# Altium schematic sheet PCB_MFG.SchDoc: PCB Manufacturing
size A4; Address1: Smoka Wawelskiego 1; Address2: 30-535 Kraków, Poland; DocumentNumber: 9; Revision: v01; SheetNumber: 9; SheetTotal: 9; Author: Miroslaw Folejewski; CompanyName: Mirko Electronics; DrawnBy: Miroslaw Folejewski; Engineer: Miroslaw Folejewski; PageSetup: Record=PageOptions|CenterHorizontal=True|CenterVertical=True|PrintScale=1.00|XCorrection=1.00|YCorrection=1.00|PrintKind=0|BorderSize=5000000|LeftOffset=0|BottomOffset=0|Orientation=2|PaperLength=1000|PaperWidth=1000|Scale=100|PaperSource=7|PrintQuality=-4|MediaType=1|DitherType=10|PaperKind=A4|PrintScaleMode=1; PageSize: A4; Designators: -; ProjectName: 7-Segment LED Matrix Display
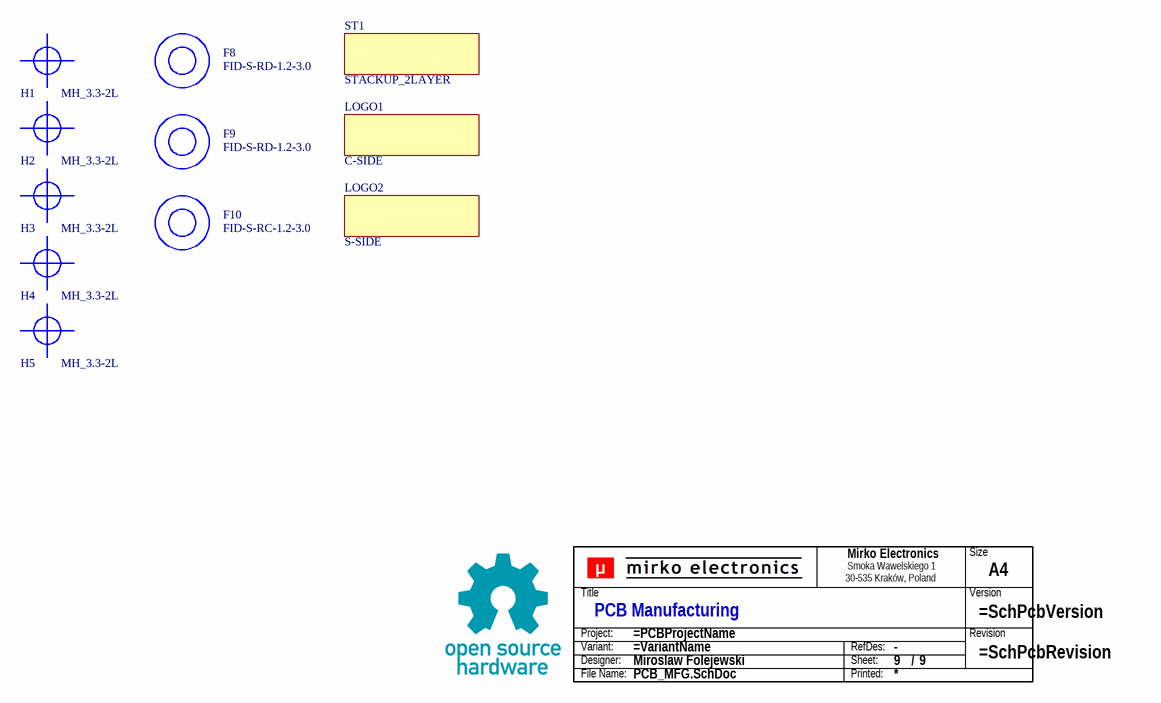
[diagram p0: PCB_MFG.SchDoc]

## Parts
?  (no value)  (graphical)
F8  FID-S-RD-1.2-3.0  [FID-S-RD-1.2-3.0]
F9  FID-S-RD-1.2-3.0  [FID-S-RD-1.2-3.0]
F10  FID-S-RC-1.2-3.0  [FID-S-RC-1.2-3.0]
H1  MH_3.3-2L  [MH_3.3-2L]
H2  MH_3.3-2L  [MH_3.3-2L]
H3  MH_3.3-2L  [MH_3.3-2L]
H4  MH_3.3-2L  [MH_3.3-2L]
H5  MH_3.3-2L  [MH_3.3-2L]
LOGO1  C-SIDE  [COMPONENT_SIDE]
LOGO2  S-SIDE  [SOLDER_SIDE]
ST1  STACKUP_2LAYER  [STACKUP_2LAYER]
TB?  Title block  (value not drawn)  (graphical)

## Notes on the sheet
- Title
- Size
- Revision
- Checked By:
- Project:
- Variant:
- Engineer:
- Date:
- Sheet:
- /
- Designators
- Approved By:
- File:
- (in symbol SCH_TITLE_BLOCK_V1) Size; Title; Version; Project:; Revision; Variant:; RefDes:; Designer:; Sheet:; /; File Name:; Printed:

## Library data of the parts
? = Title Block NeoStrain
F8-F10 = FLUICIDAL: PCB FLUICIDAL
H1-H5 = MOUNTING_HOLE: Mounting Hole
LOGO1 LOGO2 ST1 = STACKUP_2LAYER: STACKUP 2 LAYER
TB? = SCH_TITLE_BLOCK_V1: Component Type: Title block; Manufacturer: -; Mounting Type: Non component; MPN: -; Operating Temperature: -; Package: -; Specification: Title block; Value: Title block; Replacement: -; System: ?